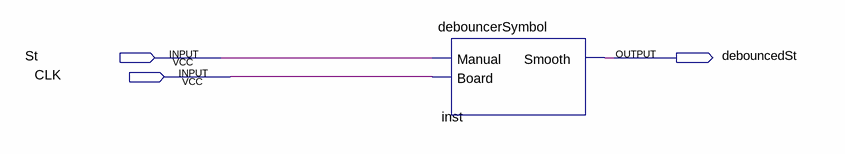
[diagram p0: schematic sheet]
// Quartus schematic debouncer.bdf as structural Verilog: 1 symbols, 3 pins
module debouncer (
  input  St,
  input  CLK,
  output debouncedSt
);

  debouncerSymbol inst (.Manual(St), .Board(CLK), .Smooth(debouncedSt));
endmodule
